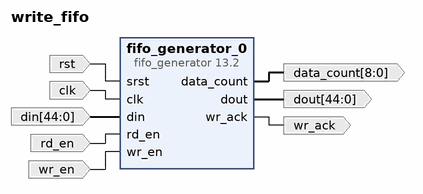
[diagram p0: block diagram of the top level]
# Vivado block design write_fifo, xc7a35ticsg324-1L, Vivado 2020.1
create_bd_design write_fifo

create_bd_port -dir I rst
create_bd_port -dir I -type clk clk
create_bd_port -dir O wr_ack
create_bd_port -dir I -from 44 -to 0 din
create_bd_port -dir O -from 44 -to 0 dout
create_bd_port -dir I rd_en
create_bd_port -dir O -from 8 -to 0 data_count
create_bd_port -dir I wr_en

create_bd_cell -type ip -vlnv xilinx.com:ip:fifo_generator:13.2 fifo_generator_0
set_property -dict [list \
  CONFIG.Data_Count true \
  CONFIG.Data_Count_Width 9 \
  CONFIG.Input_Data_Width 45 \
  CONFIG.Input_Depth 512 \
  CONFIG.Output_Data_Width 45 \
  CONFIG.Performance_Options Standard_FIFO \
  CONFIG.Write_Acknowledge_Flag true \
] [get_bd_cells fifo_generator_0]

# ---- connections ----

connect_bd_net -net srst_0_1 [get_bd_ports rst] [get_bd_pins fifo_generator_0/srst]
connect_bd_net -net clk_0_1 [get_bd_ports clk] [get_bd_pins fifo_generator_0/clk]
connect_bd_net [get_bd_pins fifo_generator_0/wr_ack] [get_bd_ports wr_ack]
connect_bd_net -net din_0_1 [get_bd_ports din] [get_bd_pins fifo_generator_0/din]
connect_bd_net [get_bd_pins fifo_generator_0/dout] [get_bd_ports dout]
connect_bd_net -net rd_en_0_1 [get_bd_ports rd_en] [get_bd_pins fifo_generator_0/rd_en]
connect_bd_net [get_bd_pins fifo_generator_0/data_count] [get_bd_ports data_count]
connect_bd_net -net wr_en_0_1 [get_bd_ports wr_en] [get_bd_pins fifo_generator_0/wr_en]

validate_bd_design
save_bd_design
